# Altium schematic sheet 65c02.SchDoc: 6502 Core
size A4; Engineer: Ming Jie See; Revision: 1; SheetNumber: 1; SheetTotal: 5
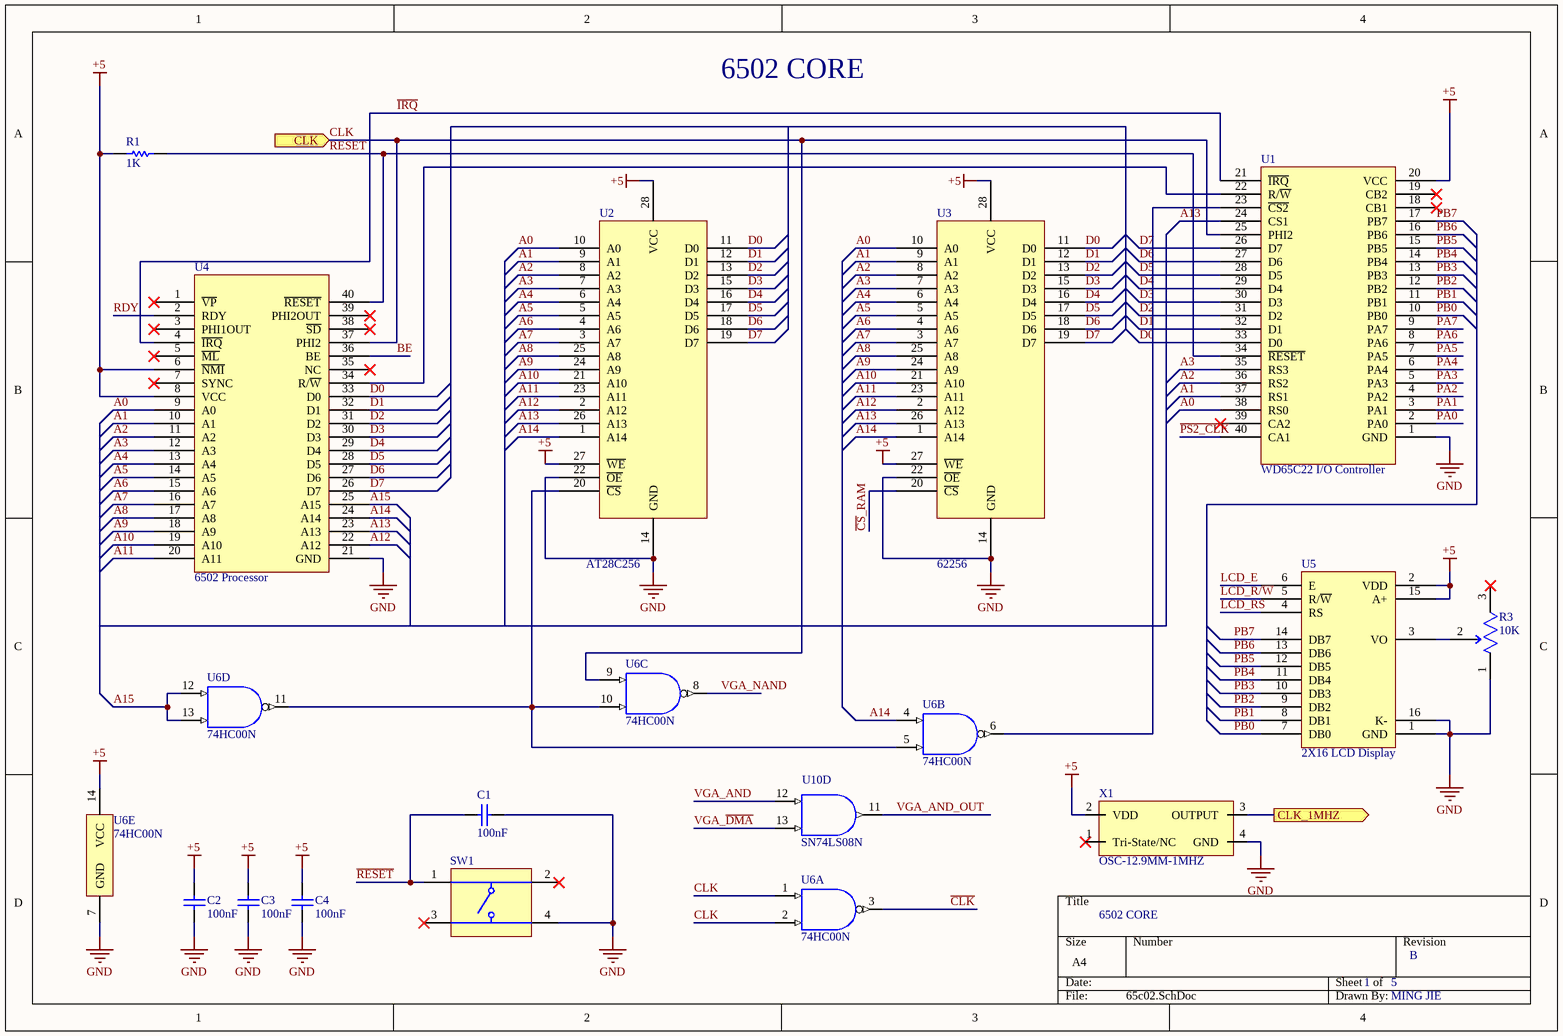
[diagram p0: 65c02.SchDoc]

## Parts
C1  Capacitance: 100nF  [CAPC2013X135X45ML10T25]  (hidden comment: GRM21BR71H104KA01L)
C2  Capacitance: 100nF  [CAPC2013X135X45ML10T25]  (hidden comment: GRM21BR71H104KA01L)
C3  Capacitance: 100nF  [CAPC2013X135X45ML10T25]  (hidden comment: GRM21BR71H104KA01L)
C4  Capacitance: 100nF  [CAPC2013X135X45ML10T25]  (hidden comment: GRM21BR71H104KA01L)
R1  Resistance: 1K  [RESC2013X50X30NL20T20]  (hidden comment: CRCW08051K00FKEA)
R3  Resistance: 10K  [FP-3296W-MFG]  (hidden comment: 3296W-1-103RLF)
SW1  K2-1102SP-C4SC-04  [TECO-FSM4JSMA_V]  (value not drawn)
U1  WD65C22 I/O Controller  [PDIP_40]
U2  AT28C256  [DIP_28]
U3  62256  [DIP_28]
U4  6502 Processor  [PDIP_40]
U5  2X16 LCD Display  [LCD_2x16]
U6  74HC00N  [NXP-SOT27-1-14]  (parts A,B,C,D,E of 5)
U10  SN74LS08N  [N0014A]  (part D of 5)
X1  OSC-12.9MM-1MHZ  [OSC_THT_12-9MM]

## Ports
CLK (in), CLK_1MHZ (out)

## Nets
+5: C2.1 C3.1 C4.1 R1.1 U1.20(VCC) U2.27(~{WE}) U2.28(VCC) U3.27(~{WE}) U3.28(VCC) U4.6(~{NMI}) U4.8(VCC) U5.2(VDD) U5.15(A+) U6.14(VCC) X1.2(VDD)
GND: C1.1 C2.2 C3.2 C4.2 R3.1(CCW) SW1.4 U1.1(GND) U2.14(GND) U2.22(~{OE}) U3.14(GND) U3.22(~{OE}) U4.21(GND) U5.1(GND) U5.16(K-) U6.7(GND) X1.4(GND)
A0: U1.38(RS0) U2.10(A0) U3.10(A0) U4.9(A0)
A1: U1.37(RS1) U2.9(A1) U3.9(A1) U4.10(A1)
A2: U1.36(RS2) U2.8(A2) U3.8(A2) U4.11(A2)
A3: U1.35(RS3) U2.7(A3) U3.7(A3) U4.12(A3)
A4: U2.6(A4) U3.6(A4) U4.13(A4)
A5: U2.5(A5) U3.5(A5) U4.14(A5)
A6: U2.4(A6) U3.4(A6) U4.15(A6)
A7: U2.3(A7) U3.3(A7) U4.16(A7)
A8: U2.25(A8) U3.25(A8) U4.17(A8)
A9: U2.24(A9) U3.24(A9) U4.18(A9)
A10: U2.21(A10) U3.21(A10) U4.19(A10)
A11: U2.23(A11) U3.23(A11) U4.20(A11)
A12: U2.2(A12) U3.2(A12) U4.22(A12)
A13: U1.24(CS1) U2.26(A13) U3.26(A13) U4.23(A13)
A14: U2.1(A14) U3.1(A14) U4.24(A14) U6.4(2A)
A15: U4.25(A15) U6.12(4A) U6.13(4B)
BE: U4.36(BE)
~{CLK}: U6.3(~{1Y})
~{CS}_RAM: U3.20(~{CS})
CLK: U1.25(PHI2) U4.37(PHI2) U6.1(1A) U6.2(1B) U6.9(3A) ; port CLK
CLK_1MHZ: X1.3(OUTPUT) ; port CLK_1MHZ
D0: U1.33(D0) U2.11(D0) U3.11(D0) U4.33(D0)
D1: U1.32(D1) U2.12(D1) U3.12(D1) U4.32(D1)
D2: U1.31(D2) U2.13(D2) U3.13(D2) U4.31(D2)
D3: U1.30(D3) U2.15(D3) U3.15(D3) U4.30(D3)
D4: U1.29(D4) U2.16(D4) U3.16(D4) U4.29(D4)
D5: U1.28(D5) U2.17(D5) U3.17(D5) U4.28(D5)
D6: U1.27(D6) U2.18(D6) U3.18(D6) U4.27(D6)
D7: U1.26(D7) U2.19(D7) U3.19(D7) U4.26(D7)
~{IRQ}: U1.21(~{IRQ}) U4.4(~{IRQ})
LCD_E: U5.6(E)
LCD_R/~{W}: U5.5(R/~{W})
LCD_RS: U5.4(RS)
~{PS2_CLK}: U1.40(CA1)
PA0: U1.2(PA0)
PA1: U1.3(PA1)
PA2: U1.4(PA2)
PA3: U1.5(PA3)
PA4: U1.6(PA4)
PA5: U1.7(PA5)
PA6: U1.8(PA6)
PA7: U1.9(PA7)
PB0: U1.10(PB0) U5.7(DB0)
PB1: U1.11(PB1) U5.8(DB1)
PB2: U1.12(PB2) U5.9(DB2)
PB3: U1.13(PB3) U5.10(DB3)
PB4: U1.14(PB4) U5.11(DB4)
PB5: U1.15(PB5) U5.12(DB5)
PB6: U1.16(PB6) U5.13(DB6)
PB7: U1.17(PB7) U5.14(DB7)
~{RESET}: C1.2 R1.2 SW1.1 U1.34(~{RESET}) U4.40(~{RESET})
RDY: U4.2(RDY)
VGA_AND: U10.12(4A)
VGA_AND_OUT: U10.11(4Y)
VGA_~{DMA}: U10.13(4B)
VGA_NAND: U6.8(~{3Y})
NetR3_2: R3.2(WIPER) U5.3(VO)
NetU1_22: U1.22(R/~{W}) U4.34(R/~{W})
NetU1_23: U1.23(~{CS2}) U6.6(~{2Y})
NetU2_20: U2.20(~{CS}) U6.5(2B) U6.10(3B) U6.11(~{4Y})

Not connected (* = marked no-connect by the designer): R3 3(CW)*; SW1 2* 3*; U1 18(CB1)* 19(CB2)* 39(CA2)*; U4 1(~{VP})* 3(PHI1OUT)* 5(~{ML})* 7(SYNC)* 35(NC)* 38(~{SD})* 39(PHI2OUT)*; X1 1(Tri-State/NC)*

## Notes on the sheet
- 6502 CORE
- 1
- 5
- B
- MING JIE

## Library data of the parts
C1-C4 = CMP-2100-03644-1: Chip Capacitor, 0.1 uF, +/- 10%, 50 V, -55 to 125 degC, 0805 (2012 Metric), RoHS, Tape and Reel; Manufacturer: Murata; Voltage: 50V; Insulation Resistance: 10GR; Dielectric Material: Ceramic; Dielectric: X7R; Package Description: 2-Pin Surface Mount Device, Body 2 x 1.25 mm; Manufacturer URL: http://www.murata.com/; Case Code (Imperial): 0805; Datasheet URL: http://psearch.en.murata.com/capacitor/product/GRM21BR71H104KA01%23.pdf; Termination: SMD/SMT; Lead Free: LeadFree; Package Quantity: 1; Mount: SurfaceMount; REACH SVHC: Unknown; Thickness: 0.053inch; Height: 1.25mm; Case/Package: 0805; Voltage Rating: 50V; Width: 0.049inch; Case Code (Metric): 2012; Material: Ceramic; Min Operating Temperature: -55degC; RoHSCompliant: true; Datasheet Version: 42675.0; Voltage Rating (DC): 50V; Tolerance: 10%; Package Reference: 0805; Depth: 1.25mm; Length: 2mm; Max Operating Temperature: 125degC; Packaging: TapeandReel; Number of Pins: 2; Radiation Hardening: No
R1 = CMP-1013-00510-2: Manufacturer: Vishay Dale; Part Number: CRCW08051K00FKEA
R3 = CMP-07234-000024-1: TRIMMER 10K OHM 0.5W PC PIN TOP; Temperature Coefficient: 100ppm/°C; Power Rating: 500mW; Tolerance: 10%; Number of Turns: 25; Width: 0.19inch; Termination: Pin; Radiation Hardening: No; Contact Plating: Tin; Composition: Cermet; Length: 9.53mm; Height: 0.395inch; Depth: 4.83mm; REACH SVHC: No SVHC; Weight: 0.03oz; Min Operating Temperature: -55°C; Military Standard: Not; Max Operating Temperature: 125°C; Packaging: Tape and Reel; Package Quantity: 1; Taper: Linear; Max Power Dissipation: 500mW; Mount: Through Hole
SW1 = CMP-2000-05602-2: Swicth, SPST, 24 V, -35 to 85 degC, 4-Pin SMD, RoHS, Tape and Reel; Manufacturer: TE Connectivity; Switch Travel: 0.25mm; Mechanical Life: 100000Cycles; Contact Current Rating: 50mA; Operating Force: 1.57N; Actuator Material: Polyamide; Contact Resistance: 100mOhm; Voltage Rating: 24V; Illumination Type: Illuminated; Actuator Length: 0.055inch; Max Voltage Rating (DC): 12V; Case\/Package: SMD/SMT; Orientation: Straight; Datasheet URL: http://www.te.com/commerce/DocumentDelivery/DDEController?Action=showdoc&DocId=Customer+Drawing%7F2-1437565-7%7FV%7Fpdf%7FEnglish%7FENG_CD_2-1437565-7_V.pdf%7F4-1437565-2; Min Operating Temperature: -35degC; Packaging: LoosePiece; Termination: GullWing; Throw Configuration: SPST; Package Description: 4-Pin Surface Mount Device, Body 6 x 6 mm, Pitch 4.5 mm; Mounting Technology: SurfaceMount; Contact Plating: Silver; Datasheet Version: Rev. V, 02/2015; RoHSCompliant: true; Max Operating Temperature: 85degC; Length: 6mm; Voltage Rating (DC): 24V; Electrical Life: 100000Cycles; Current Rating: 50mA; Package Quantity: 750; Mount: SurfaceMount; Package Reference: FSM4JSMA; Manufacturer URL: http://www.te.com/; Width: 6mm; REACH SVHC: Unknown; Contact Material: CopperAlloy
U1 = WD65C22: WD65C22 PDIP-40, I/O Controller
U2 = AT28C256: Paged Parallel EEPROM AT28C256
U3 = 62256: 32K x 8, SRAM
U4 = WDC65C02: WDC 6502 PDIP-40
U5 = LCM1602C: 2X16 LCD Display, Parallel input
U6 = CMP-0976-00001-1: Quad 2-input NAND gate, CMOS, 2 to 6 V, -40 to 125 degC, 14-Pin DIP (SOT27-1), RoHS, Bulk; Manufacturer: NXP Semiconductors; VCC (V): 2 to 6; Nr of bits: 4; tpd (ns): 7; Output drive capability (mA): +/- 5.2; fmax (MHz): 36; PackageReference: SOT27-1; ComponentLink1URL: http://www.nxp.com/; ComponentLink3Description: Package Specification; ComponentLink1Description: Manufacturer URL; DatasheetVersion: Rev. 6; Temperature Range: -40 to 125 degC; ComponentLink2Description: Datasheet; RoHS: TRUE; ComponentLink2URL: http://www.nxp.com/documents/data_sheet/74HC_HCT00.pdf; PackageVersion: Feb-03; PartNumber: 74HC00N; Input levels: CMOS; PackageDescription: 14-Pin plastic dual in-line package, Body 19.025 x 6.34 mm, Pitch 2.54 mm; Mounting Technology: Through Hole; ComponentLink3URL: http://www.nxp.com/documents/outline_drawing/sot027-1_po.pdf; Packing: Bulk
U10 = CMP-0777-00259-3: Quadruple 2-Input Positive-AND Gates, N0014A, TUBE; Manufacturer: Texas Instruments; VCC(Max)(V): 5.25; ICC @ Nom Voltage(Max)(mA): 0.021; VCC(Min)(V): 4.75; tpd @ Nom Voltage(Max)(ns): 25; Rating: Catalog; Output Type: TTL; Bits(#): 4; Schmitt Trigger: No; Voltage(Nom)(V): 5; Technology Family: LS; F @ Nom Voltage(Max)(Mhz): 35; Output Drive (IOL/IOH)(Max)(mA): -0.8/16; PackageReference: N0014A; DatasheetVersion: SDLS033; Input Type: TTL; Operating Temperature Range(C): 0 to 70; Generic Part Number: SN74LS08
X1 = OSC-12.9MM-1MHZ: 12.9MM x 12.9MM, 1MHz Can Oscillator